# Altium project PCB_HOMEWORK_LM2596_QuocThang_V2.PrjPcb
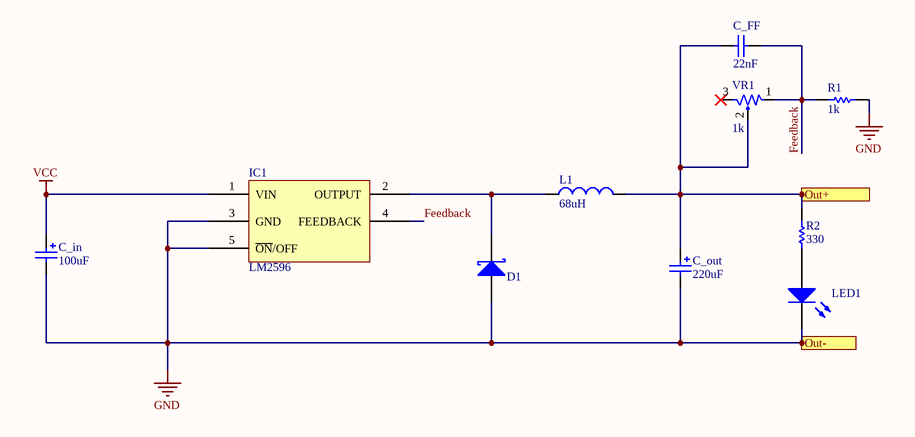
[diagram p0: LM2596.SchDoc]
1 sheet, 10 parts. Net scope: flat (ports and power ports of the same name join across sheets).
Board file: 2023-04-28_PIFHomework_LM2596_ThangHo_V1-01.PcbDoc

## Sheet LM2596.SchDoc
size A4; SheetNumber: 1; SheetTotal: 1

### Parts
C_FF  22nF  [CAP-0805]
C_in  100uF  [CAP-ALU]
C_out  220uF  [CAP-ALU]
D1  D Schottky  [SS34]  (value not drawn)
IC1  LM2596  [LM2596]
L1  68uH  [INDUCTOR]
LED1  (no value)  [LED-0805]
R1  1k  [RES-SMD-0805]
R2  330  [RES-SMD-0805]
VR1  1k  [Varistor]

### Ports
Out+, Out-

### Nets
GND: C_in.2 C_out.2 D1.1(A) IC1.3(GND) IC1.5(~{ON}/OFF) LED1.2(K) R1.1 ; port Out-
VCC: C_in.1 IC1.1(VIN)
Feedback: C_FF.1 IC1.4(FEEDBACK) R1.2 VR1.1
NetC_FF_2: C_FF.2 C_out.1 L1.2 R2.1 VR1.2 ; port Out+
NetD1_2: D1.2(K) IC1.2(OUTPUT) L1.1
NetLED1_1: LED1.1(A) R2.2

Not connected (* = marked no-connect by the designer): VR1 3*

### Notes on the sheet
- Title
- Size
- A4
- Number
- Revision
- Date:
- Drawn By: Quoc Thang
- Time:
- Checked By:
- File: D\Altium\Templates

### Library data of the parts
C_FF = CAP-SMD-0805
C_in C_out = CAP-ALUM
D1 = D Schottky: Schottky Diode; Published: 8-Jun-2000; LatestRevisionDate: 17-Jul-2002; LatestRevisionNote: Re-released for DXP Platform.; PackageReference: SMB; Publisher: Altium Limited; PackageDescription: DO-214-AA/SMB; 2 C-Bend Leads; Body 5.3 x 3.6 mm, inc. leads (LxW); Code_JEDEC: DO-214-AA
L1 = INDUCTOR
LED1 = LED-0805
R1 R2 = RES-SMD-0805
VR1 = Varistor